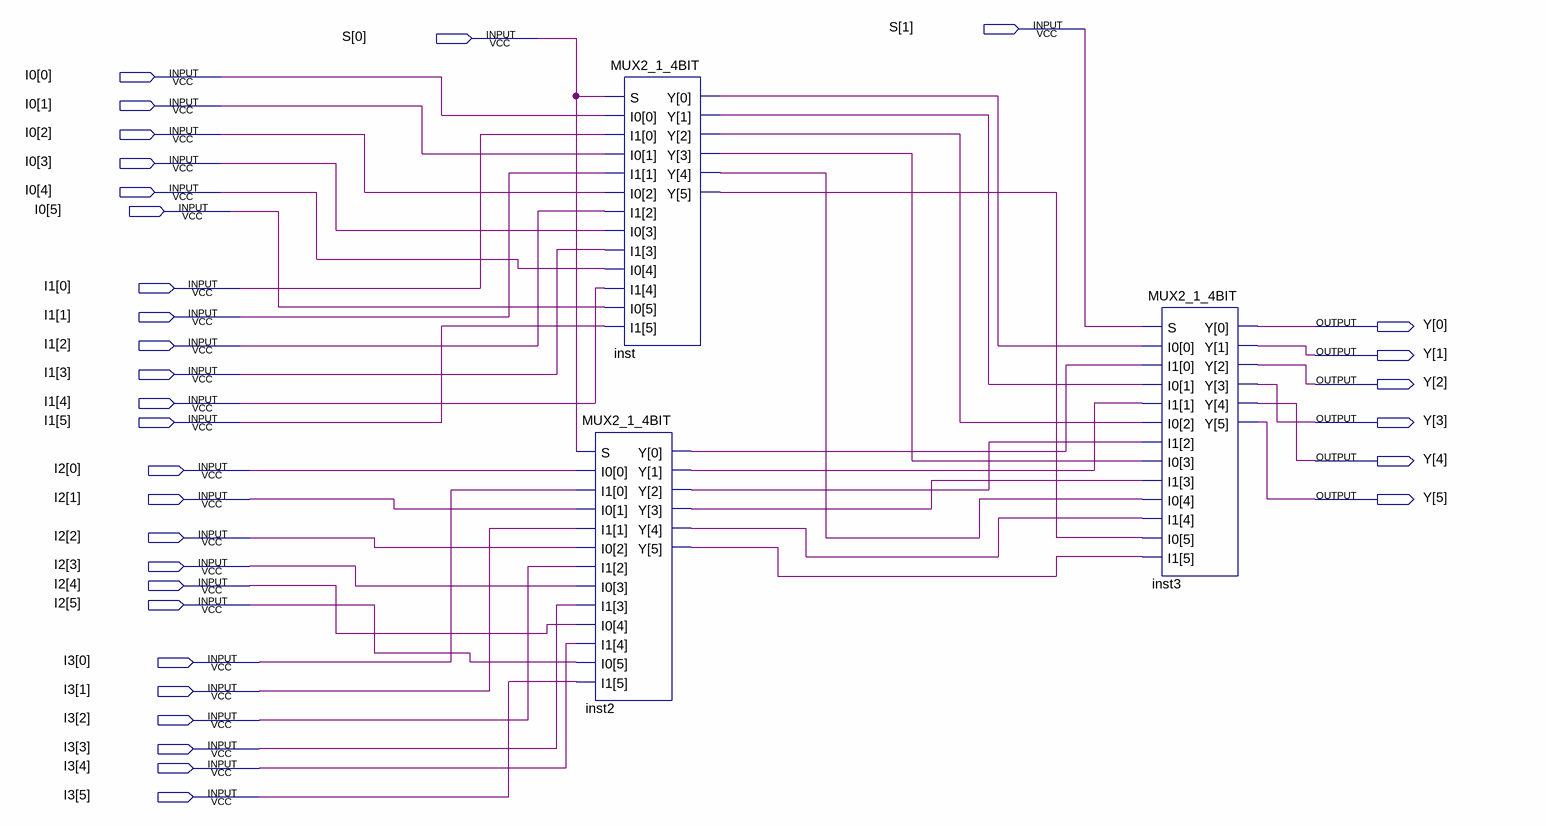
[diagram p0: schematic sheet]
// Quartus schematic MUX4_1.bdf as structural Verilog: 3 symbols, 32 pins
module MUX4_1 (
  input  [1:0] S,
  input  [5:0] I0,
  input  [5:0] I1,
  input  [5:0] I2,
  input  [5:0] I3,
  output [5:0] Y
);

  wire inst2_y, inst2_y_2, inst2_y_3, inst2_y_4, inst2_y_5, inst2_y_6, inst_y, inst_y_2, inst_y_3, inst_y_4,
       inst_y_5, inst_y_6;

  MUX2_1_4BIT inst (.S(S[0]), .I0(I0), .I1(I1), .Y({inst_y_6, inst_y_5, inst_y_4, inst_y_3, inst_y_2, inst_y}));
  MUX2_1_4BIT inst2 (.S(S[0]), .I0(I2), .I1(I3), .Y({inst2_y_6, inst2_y_5, inst2_y_3, inst2_y_2, inst2_y, inst2_y_4}));
  MUX2_1_4BIT inst3 (
    .S(S[1]), .I0({inst_y_6, inst_y_5, inst_y_4, inst_y_3, inst_y_2, inst_y}),
    .I1({inst2_y_6, inst2_y_5, inst2_y_3, inst2_y_2, inst2_y, inst2_y_4}), .Y(Y));
endmodule
